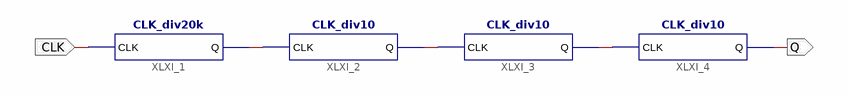
[diagram p0: schematic sheet 1]
// Xilinx ISE schematic CLK_div20M.sch (spartan6) as structural Verilog: 4 symbols, 2 ports
module CLK_div20M (
  input  CLK,
  output Q
);

  wire XLXN_1, XLXN_2, XLXN_3;

  CLK_div20k XLXI_1 (.CLK(CLK), .Q(XLXN_1));
  CLK_div10 XLXI_2 (.CLK(XLXN_1), .Q(XLXN_2));
  CLK_div10 XLXI_3 (.CLK(XLXN_2), .Q(XLXN_3));
  CLK_div10 XLXI_4 (.CLK(XLXN_3), .Q(Q));
endmodule
